# EAGLE design FM Transceiver Module (EAGLE 6.3)
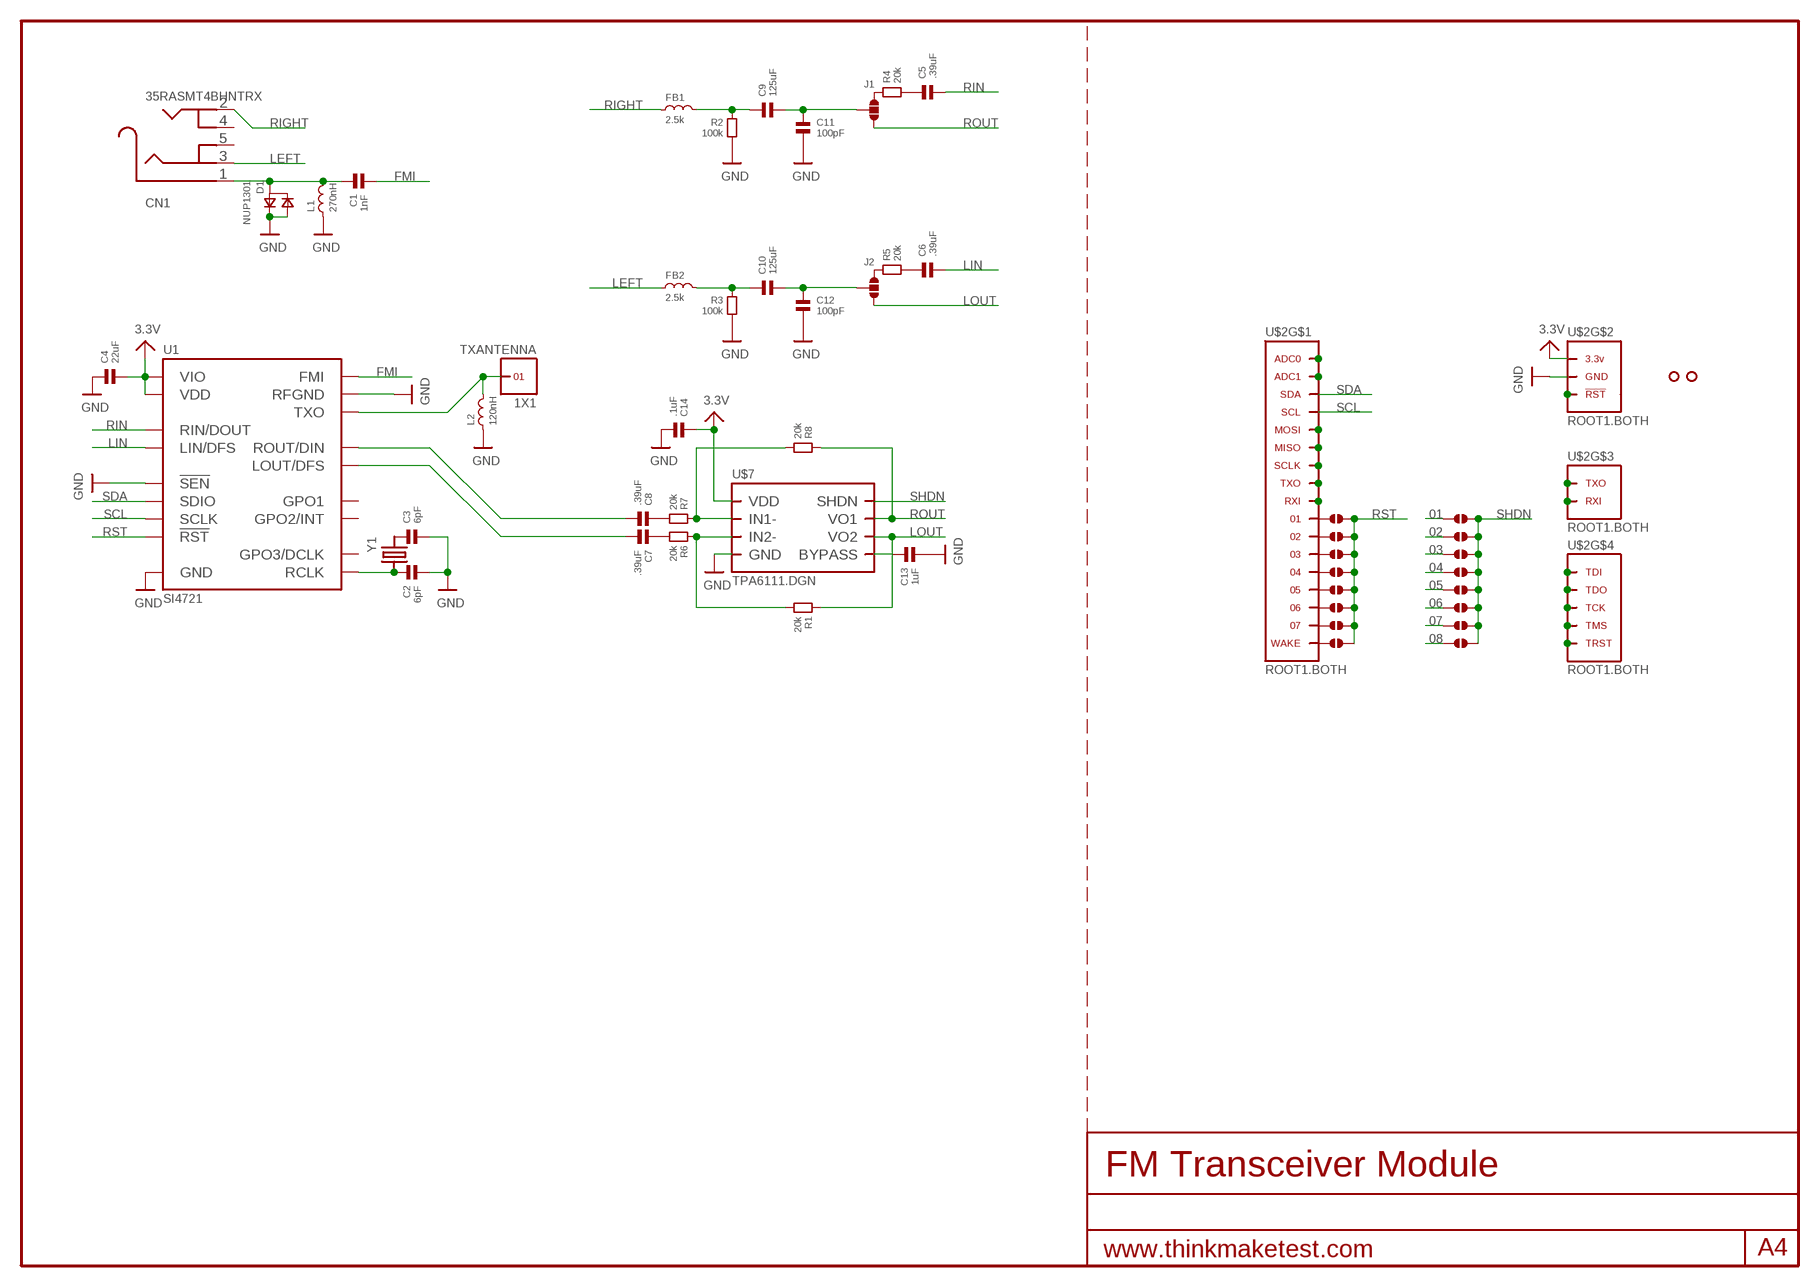
[diagram p0: schematic, sheet 1]

## Parts
C1  1nF  CAPACITOR.0603  [0603]
C2  6pF  CAPACITOR.0603  [0603]
C3  6pF  CAPACITOR.0603  [0603]
C4  22uF  CAPACITOR.0805  [0805]
C5  .39uF  CAPACITOR.0603  [0603]
C6  .39uF  CAPACITOR.0603  [0603]
C7  .39uF  CAPACITOR.0603  [0603]
C8  .39uF  CAPACITOR.0603  [0603]
C9  125uF  CAPACITOR.0603  [0603]
C10  125uF  CAPACITOR.0603  [0603]
C11  100pF  CAPACITOR.0603  [0603]
C12  100pF  CAPACITOR.0603  [0603]
C13  1uF  CAPACITOR.0603  [0603]
C14  .1uF  CAPACITOR.0603  [0603]
CN1  35RASMT4BHNTRX  AUDIO_3.5MMJACK  [4UCONN_19269]
D1  NUP1301  [SOT23]
FB1  2.5k  RF-INDUCTOR.0603  [0603]
FB2  2.5k  RF-INDUCTOR.0603  [0603]
J1  SOLDERJUMPER.3.LRG.12  [3.LRG.12]
J2  SOLDERJUMPER.3.LRG.12  [3.LRG.12]
J3  SOLDERJUMPER.2.SML  [2.SML]
J4  SOLDERJUMPER.2.SML  [2.SML]
J5  SOLDERJUMPER.2.SML  [2.SML]
J6  SOLDERJUMPER.2.SML  [2.SML]
J7  SOLDERJUMPER.2.SML  [2.SML]
J8  SOLDERJUMPER.2.SML  [2.SML]
J9  SOLDERJUMPER.2.SML  [2.SML]
J10  SOLDERJUMPER.2.SML  [2.SML]
J11  SOLDERJUMPER.2.SML  [2.SML]
J12  SOLDERJUMPER.2.SML  [2.SML]
J13  SOLDERJUMPER.2.SML  [2.SML]
J14  SOLDERJUMPER.2.SML  [2.SML]
J15  SOLDERJUMPER.2.SML  [2.SML]
J16  SOLDERJUMPER.2.SML  [2.SML]
J17  SOLDERJUMPER.2.SML  [2.SML]
J18  SOLDERJUMPER.2.SML  [2.SML]
L1  270nH  RF-INDUCTOR.0603  [0603]
L2  120nH  RF-INDUCTOR.0603  [0603]
R1  20k  RESISTOR.0603  [0603]
R2  100k  RESISTOR.0603  [0603]
R3  100k  RESISTOR.0603  [0603]
R4  20k  RESISTOR.0603  [0603]
R5  20k  RESISTOR.0603  [0603]
R6  20k  RESISTOR.0603  [0603]
R7  20k  RESISTOR.0603  [0603]
R8  20k  RESISTOR.0603  [0603]
TXANTENNA  1X1  [1X1]
U1  SI4721  SI472X  [QFN20]
U$2  ROOT1.BOTH  [ROOT1.BOTH]
U$3  HOLE.2MM  [2MM]
U$4  HOLE.2MM  [2MM]
U$7  TPA6111.DGN  [DGN]
Y1  CRYSTAL.ABS07  [ABS07]

## Nets
01: J3.1 J11.1 U$2.01 U$2.01@1 U$2.01@VIA
02: J4.1 J12.1 U$2.02 U$2.02@1 U$2.02@VIA
03: J5.1 J13.1 U$2.03 U$2.03@1 U$2.03@VIA
3.3V: C4.2 C14.1 U1.10(VIO) U1.11(VDD) U$2.3.3V@1(3.3V) U$2.3.3V@2(3.3V) U$2.3.3V@3(3.3V) U$2.3.3V@4(3.3V) U$2.3.3V@5(3.3V) U$2.3.3V@6(3.3V) U$2.3.3V@7(3.3V) U$2.3.3V@8(3.3V) U$2.3.3V@9(3.3V) U$2.3.3V@10(3.3V) U$2.3.3V@11(3.3V) U$2.3.3V@12(3.3V) U$2.3.3V@13(3.3V) U$2.3.3V@14(3.3V) U$2.3.3V@15(3.3V) U$2.3.3V@16(3.3V) U$2.3.3V@17(3.3V) U$2.3.3V@18(3.3V) U$2.3.3V@19(3.3V) U$2.3.3V@20(3.3V) U$2.3.3V@21(3.3V) U$2.3.3V@22(3.3V) U$2.3.3V@23(3.3V) U$2.3.3V@24(3.3V) U$2.3.3V@VIA(3.3V) U$7.8(VDD)
04: J6.1 J14.1 U$2.04 U$2.04@1 U$2.04@VIA
05: J7.1 J15.1 U$2.05 U$2.05@1 U$2.05@VIA
06: J8.1 J16.1 U$2.06 U$2.06@1 U$2.06@VIA
07: J9.1 J17.1 U$2.07 U$2.07@1 U$2.07@VIA
08: J10.1 J18.1 U$2.WAKE U$2.WAKE@1(WAKE) U$2.WAKE@VIA(WAKE)
FMI: C1.2 U1.2(FMI)
GND: C2.2 C3.2 C4.1 C11.2 C12.2 C13.2 C14.2 D1.1 D1.2 L1.1 L2.1 R2.2 R3.2 U1.3(RFGND) U1.6(!SEN) U1.12(GND) U1.PAD(GND) U$2.GND@1(GND) U$2.GND@2(GND) U$2.GND@3(GND) U$2.GND@4(GND) U$2.GND@5(GND) U$2.GND@6(GND) U$2.GND@7(GND) U$2.GND@8(GND) U$2.GND@9(GND) U$2.GND@10(GND) U$2.GND@11(GND) U$2.GND@12(GND) U$2.GND@13(GND) U$2.GND@14(GND) U$2.GND@15(GND) U$2.GND@16(GND) U$2.GND@17(GND) U$2.GND@18(GND) U$2.GND@19(GND) U$2.GND@20(GND) U$2.GND@21(GND) U$2.GND@22(GND) U$2.GND@23(GND) U$2.GND@24(GND) U$2.GND@25(GND) U$2.GND@26(GND) U$2.GND@VIA(GND) U$7.4(GND) U$7.PAD(GND)
LEFT: CN1.3 FB2.1
LIN: C6.2 U1.16(LIN/DFS)
LOUT: J2.3 R1.1 U$7.7(VO2)
LOUT.AMP: C7.2 U1.14(LOUT/DFS)
N$2: U$2.ADC1 U$2.ADC1@1(ADC1) U$2.ADC1@VIA(ADC1)
N$3: C13.1 U$7.3(BYPASS)
N$6: U$2.MISO U$2.MISO@1(MISO) U$2.MISO@VIA(MISO)
N$7: U$2.SCLK U$2.SCLK@1(SCLK) U$2.SCLK@VIA(SCLK)
N$8: U$2.TXO U$2.TXO@1(TXO) U$2.TXO@VIA(TXO)
N$9: U$2.RXI U$2.RXI@1(RXI) U$2.RXI@VIA(RXI)
N$12: U$2.MOSI U$2.MOSI@1(MOSI) U$2.MOSI@VIA(MOSI)
N$13: U$2.ADC0 U$2.ADC0@1(ADC0) U$2.ADC0@VIA(ADC0)
N$18: U$2.TDI U$2.TDI@1(TDI) U$2.TDI@VIA(TDI)
N$19: U$2.TDO U$2.TDO@1(TDO) U$2.TDO@VIA(TDO)
N$20: U$2.TCK U$2.TCK@1(TCK) U$2.TCK@VIA(TCK)
N$21: U$2.TMS U$2.TMS@1(TMS) U$2.TMS@VIA(TMS)
N$22: U$2.TRST U$2.TRST@1(TRST) U$2.TRST@VIA(TRST)
N$23: U$2.RXI.DBG(RXI) U$2.RXI.DBG@1(RXI) U$2.RXI.DBG@VIA(RXI)
N$24: U$2.TXO.DBG(TXO) U$2.TXO.DBG@1(TXO) U$2.TXO.DBG@VIA(TXO)
N$25: U$2.RST(!RST) U$2.RST@1(!RST) U$2.RST@VIA(!RST)
N$26: R7.1 R8.2 U$7.2(IN1-)
N$27: C1.1 CN1.1 D1.3 L1.2
N$28: C2.1 U1.9(RCLK) Y1.2
N$29: C9.2 C11.1 J1.2
N$31: C3.1 Y1.1
N$32: C10.2 C12.1 J2.2
N$33: C5.1 R4.2
N$34: C8.1 R7.2
N$35: C6.1 R5.2
N$36: C7.1 R6.2
N$37: C9.1 FB1.2 R2.1
N$38: C10.1 FB2.2 R3.1
N$39: R1.2 R6.1 U$7.6(IN2-)
N$42: J2.1 R5.1
N$43: J1.1 R4.1
RIGHT: CN1.2 FB1.1
RIN: C5.2 U1.15(RIN/DOUT)
ROUT: J1.3 R8.1 U$7.1(VO1)
ROUT.AMP: C8.2 U1.13(ROUT/DIN)
RST: J3.2 J4.2 J5.2 J6.2 J7.2 J8.2 J9.2 J10.2 U1.5(!RST)
SCL: U1.7(SCLK) U$2.SCL U$2.SCL@1(SCL) U$2.SCL@VIA(SCL)
SDA: U1.8(SDIO) U$2.SDA U$2.SDA@1(SDA) U$2.SDA@VIA(SDA)
SHDN: J11.2 J12.2 J13.2 J14.2 J15.2 J16.2 J17.2 J18.2 U$7.5(SHDN)
TXO: L2.2 TXANTENNA.1 U1.4(TXO)
Unconnected: CN1.4 CN1.5 U1.17(GPO3/DCLK) U1.18(GPO2/INT) U1.19(GPO1)

## Library data of the parts
C1-C14 = .standardparts:CAPACITOR
CN1 = microbuilder:AUDIO_3.5MMJACK: 3.5MM Audio Jack These are normally connected as follows, from left-to right on the schematic symbol above: Tip: Left Audio Inner Ring: Right Audio Shell: Common/GND
D1 = nxp:NUP1301
FB1 FB2 L1 L2 = .standardparts:RF-INDUCTOR
J1 J2 = .solderjumper:SOLDERJUMPER.3
J3-J18 = .solderjumper:SOLDERJUMPER.2
R1-R8 = .standardparts:RESISTOR
TXANTENNA = .headers(.1in):1X1
U1 = silabs:SI472X
U$2 = thinkmaketest:ROOT1
U$3 U$4 = .screw_holes:HOLE
U$7 = .packages(ti):TPA6111
Y1 = abracon:CRYSTAL

## Board
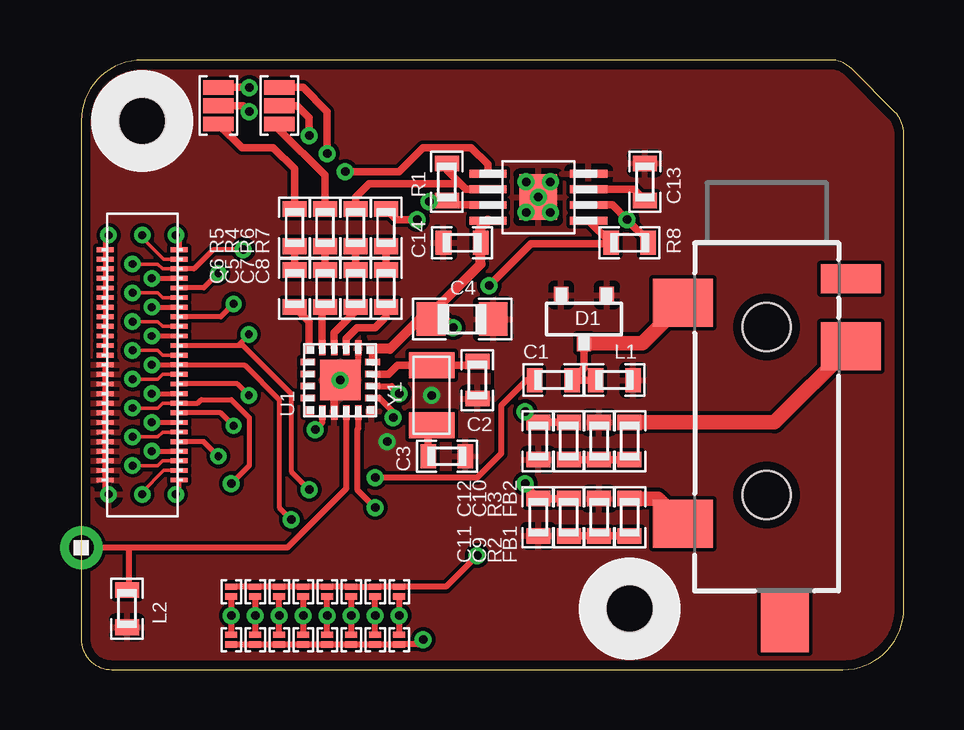
[diagram p1: board, top side]
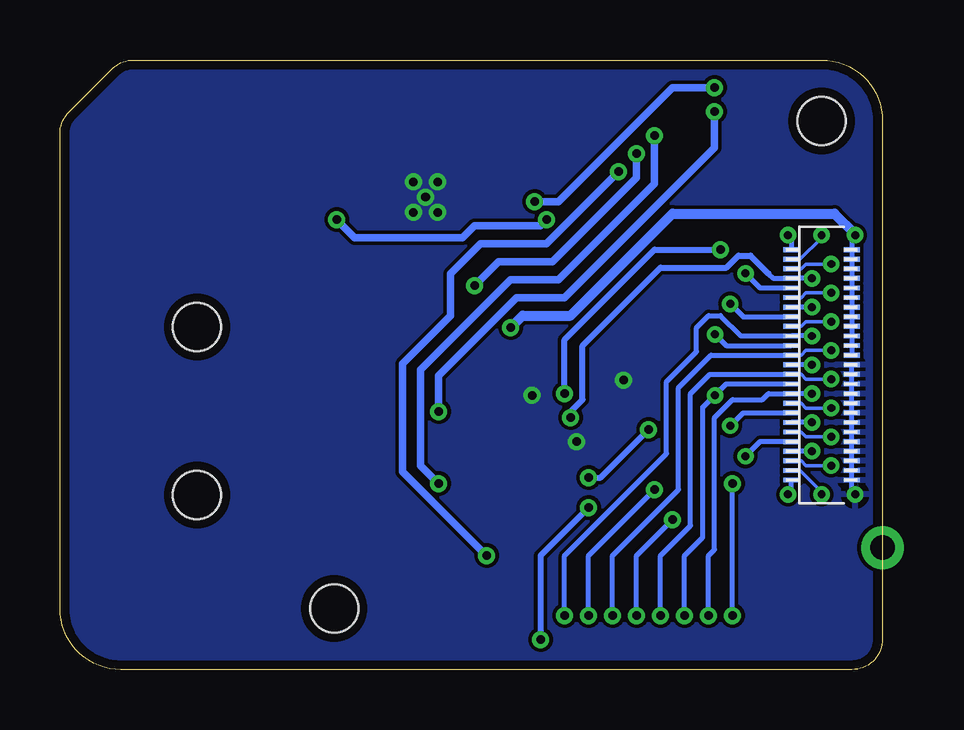
[diagram p2: board, bottom side, seen from below]

Size 34.29 x 25.4 mm. Coordinates in mm from the lower left corner, seen from the top.
Outline: 0,22.86 0,1.27 arc90 1.27,0 31.75,0 arc90 34.29,2.54 34.29,22.33 arc45 33.92,23.23 32.12,25.03 arc45 31.22,25.4 2.54,25.4 arc90 0,22.86
Copper layers (1*16): Top 0.0356mm / dielectric 1.5011mm / Bottom 0.0356mm
Design rules "default": minimum track width 6mil, minimum drill 13mil, track to track 6mil, track to pad 6mil, pad to pad 6mil, via to via 6mil, smd to smd 6mil, copper to edge 15mil, drill to drill 6mil, minimum pad ring 7mil, minimum via ring 7mil, stop-mask expansion 4mil, vias tented up to drill 16mil, thermal gap 10mil
tRestrict: 1 lines

### Footprints (pad centres in the part's own frame; a part is rotated, then mirrored left to right if it is on the bottom)
0603 = smd 0.65 x 1: 1 -0.775,0; 2 0.775,0
0805 = smd 1.2 x 1.4: 1 -1.3,0; 2 1.3,0
4UCONN_19269 = smd 2 x 2.5: 1 2.5,-3.5; 2 11.7,-3.5; 3 4.3,3.5 | smd 2.5 x 2: 4 15.8,0.75 | smd 1.2 x 2.5: 5 1.5,3.5 | hole 2: 3.5,0; 10.5,0
SOT23 = smd 0.6 x 0.7: 1 -0.95,-1; 2 0.95,-1; 3 0,1
3.LRG.12 = smd 0.61 x 1.27: 1 -0.762,0; 2 0,0; 3 0.762,0
2.SML = smd 0.254 x 0.508: 1 -0.203,0; 2 0.203,0
1X1 = drill 1.016 pad 1.778: 1 0,0
QFN20 = smd 0.4 x 0.4: 1 -1.3,1.3; 6 -1.3,-1.3; 11 1.3,-1.3; 16 1.3,1.3 | smd 0.61 x 0.28: 2 -1.345,0.75; 3 -1.345,0.25; 4 -1.345,-0.25; 5 -1.345,-0.75; 12 1.345,-0.75; 13 1.345,-0.25; 14 1.345,0.25; 15 1.345,0.75 | smd 0.28 x 0.61: 7 -0.75,-1.345; 8 -0.25,-1.345; 9 0.25,-1.345; 10 0.75,-1.345; 17 0.75,1.345; 18 0.25,1.345; 19 -0.25,1.345; 20 -0.75,1.345 | smd 1.7 x 1.7: PAD 0,0
ROOT1.BOTH = smd 0.66 x 0.2 bottom: 01 3.795,13.9; 02 3.795,13.5; 03 3.795,13.1; 3.3V@1 1.285,17.5; 3.3V@2 1.285,17.1; 3.3V@3 1.285,16.7; 3.3V@4 1.285,16.3; 3.3V@5 1.285,15.9; 3.3V@6 1.285,15.5; 3.3V@7 1.285,15.1; 3.3V@8 1.285,14.7; 3.3V@9 1.285,14.3; 3.3V@10 1.285,13.9; 3.3V@11 1.285,13.5; 3.3V@12 1.285,13.1; 04 3.795,12.7; 05 3.795,12.3; 06 3.795,11.9; 07 3.795,11.5; ADC0 3.795,17.5; ADC1 3.795,17.1; GND@1 1.285,7.9; GND@2 1.285,8.3; GND@3 1.285,8.7; GND@4 1.285,9.1; GND@5 1.285,9.5; GND@6 1.285,9.9; GND@7 1.285,10.3; GND@8 1.285,10.7; GND@9 1.285,11.1; GND@10 1.285,11.5; GND@11 1.285,11.9; GND@12 1.285,12.3; GND@13 1.285,12.7; MISO 3.795,15.5; MOSI 3.795,15.9; RST 3.795,7.9; RXI 3.795,14.3; RXI.DBG 3.795,10.3; SCL 3.795,16.3; SCLK 3.795,15.1; SDA 3.795,16.7; TCK 3.795,9.1; TDI 3.795,9.9; TDO 3.795,9.5; TMS 3.795,8.7; TRST 3.795,8.3; TXO 3.795,14.7; TXO.DBG 3.795,10.7; WAKE 3.795,11.1 | smd 0.7 x 0.2: 01@1 4.08,13.9; 02@1 4.08,13.5; 3.3V@13 1,17.5; 3.3V@14 1,17.1; 3.3V@15 1,16.7; 3.3V@16 1,16.3; 3.3V@17 1,15.9; 3.3V@18 1,15.5; 3.3V@19 1,15.1; 3.3V@20 1,14.7; 3.3V@21 1,14.3; 3.3V@22 1,13.9; 3.3V@23 1,13.5; 3.3V@24 1,13.1; 03@1 4.08,13.1; 04@1 4.08,12.7; 05@1 4.08,12.3; 06@1 4.08,11.9; 07@1 4.08,11.5; ADC0@1 4.08,17.5; ADC1@1 4.08,17.1; GND@14 1,7.9; GND@15 1,8.3; GND@16 1,8.7; GND@17 1,9.1; GND@18 1,9.5; GND@19 1,9.9; GND@20 1,10.3; GND@21 1,10.7; GND@22 1,11.1; GND@23 1,11.5; GND@24 1,11.9; GND@25 1,12.3; GND@26 1,12.7; MISO@1 4.08,15.5; MOSI@1 4.08,15.9; RST@1 4.08,7.9; RXI.DBG@1 4.08,10.3; RXI@1 4.08,14.3; SCL@1 4.08,16.3; SCLK@1 4.08,15.1; SDA@1 4.08,16.7; TCK@1 4.08,9.1; TDI@1 4.08,9.9; TDO@1 4.08,9.5; TMS@1 4.08,8.7; TRST@1 4.08,8.3; TXO.DBG@1 4.08,10.7; TXO@1 4.08,14.7; WAKE@1 4.08,11.1 | drill 0.33 pad 0.686: 01@VIA 2.94,13.9; 02@VIA 6.985,13.97; 3.3V@VIA 1.14,18.1; 03@VIA 2.14,13.3; 04@VIA 2.94,12.7; 05@VIA 2.14,12.1; 06@VIA 6.985,11.43; 07@VIA 2.94,11.5; ADC0@VIA 3.94,18.1; ADC1@VIA 2.54,18.1; GND@VIA 1.14,7.3; MISO@VIA 2.14,15.7; MOSI@VIA 5.715,16.51; RST@VIA 3.94,7.3; RXI.DBG@VIA 2.94,10.3; RXI@VIA 2.14,14.5; SCL@VIA 2.94,16.3; SCLK@VIA 2.94,15.1; SDA@VIA 2.14,16.9; TCK@VIA 2.94,9.1; TDI@VIA 2.14,9.7; TDO@VIA 5.715,8.89; TMS@VIA 2.14,8.5; TRST@VIA 2.54,7.3; TXO.DBG@VIA 6.35,10.16; TXO@VIA 6.35,15.24; WAKE@VIA 2.14,10.9
2MM = hole 2: 0,0
DGN = smd 0.33 x 1.55: 1 -0.975,-2.1; 2 -0.325,-2.1; 3 0.325,-2.1; 4 0.975,-2.1; 5 0.975,2.1; 6 0.325,2.1; 7 -0.325,2.1; 8 -0.975,2.1 | smd 1.89 x 1.57: PAD 0,0
ABS07 = smd 1.1 x 1.9: 1 -1.25,0; 2 1.25,0

### Placement (x,y rotation side)
C1  19.68,12.06 180 top
C2  16.51,12.06 270 top
C3  15.24,8.89 0 top
C4  15.88,14.61 180 top
C5  10.16,15.88 270 top
C6  8.89,15.88 270 top
C7  11.43,15.88 270 top
C8  12.7,15.88 270 top
C9  20.32,6.35 90 top
C10  20.32,9.53 90 top
C11  19.05,6.35 270 top
C12  19.05,9.53 270 top
C13  23.5,20.32 90 top
C14  15.88,17.78 180 top
CN1  28.57,17.78 270 top
D1  20.95,14.61 180 top
FB1  22.86,6.35 270 top
FB2  22.86,9.53 270 top
J1  8.26,23.5 90 top
J2  5.71,23.5 90 top
J3  13.25,1.25 270 top
J4  12.25,1.25 270 top
J5  11.25,1.25 270 top
J6  10.25,1.25 270 top
J7  9.25,1.25 270 top
J8  8.25,1.25 270 top
J9  7.25,1.25 270 top
J10  6.25,1.25 270 top
J11  13.25,3.25 90 top
J12  12.25,3.25 90 top
J13  11.25,3.25 90 top
J14  10.25,3.25 90 top
J15  9.25,3.25 90 top
J16  8.25,3.25 90 top
J17  7.25,3.25 90 top
J18  6.25,3.25 90 top
L1  22.23,12.06 180 top
L2  1.91,2.54 90 top
R1  15.24,20.32 90 top
R2  21.59,6.35 90 top
R3  21.59,9.53 90 top
R4  10.16,18.41 270 top
R5  8.89,18.41 270 top
R6  11.43,18.41 270 top
R7  12.7,18.41 270 top
R8  22.86,17.78 0 top
TXANTENNA  0,5.08 0 top
U1  10.79,12.06 90 top
U$2  0,0 0 top
U$3  22.86,2.54 90 top
U$4  2.54,22.86 90 top
U$7  19.05,19.68 90 top
Y1  14.61,11.43 90 top

### Tracks (layer width: path | path; a pad name or v marks a point on that pad's centre or on a via)
01  (via drill 0.36)
  Top 0.254: J11.1 v13.25,2.25 J3.1
  Bottom 0.203: v13.25,2.25 13.25,4.75 9,9 9,12 7.75,13.25 7.75,14.25 7.25,14.75 6.75,14.75 5.9,13.9 U$2.01
02  (via drill 0.36)
  Top 0.203: v9.5,7.5 8.75,8.25 8.75,11.5 6.75,13.5 6.51,13.5
  Top 0.254: J4.1 v12.25,2.25 J12.1
  Bottom 0.203: v12.25,2.25 12.25,4.75 v9.5,7.5
03  (via drill 0.36)
  Top 0.254: J13.1 v11.25,2.25 J5.1
  Bottom 0.203: v11.25,2.25 11.25,4.75 8.5,7.5 8.5,11.75 7.15,13.1 U$2.03
3.3V  (via drill 0.36)
  Top 0.305: U1.10 12.14,13.32 U1.11
  Top 0.406: C4.2 14.11,14.61 12.87,13.37 U1.11 | C4.2 14.57,14.82 16.65,16.9 C14.1 16.65,18.41 U$7.8 | C4.2 15.14,14.61 v15.5,14.25
  Bottom 0.406: v15.5,14.25 15,14.75 13,14.75 8.75,19 2,19 1.14,18.14 U$2.3.3V@VIA
04  (via drill 0.36)
  Top 0.203: U$2.04@1 6.8,12.7 8.25,11.25 8.25,6.75 v8.75,6.25
  Top 0.254: J6.1 v10.25,2.25 J14.1
  Bottom 0.203: v10.25,2.25 10.25,4.75 v8.75,6.25
05  (via drill 0.36)
  Top 0.254: J15.1 v9.25,2.25 J7.1
  Bottom 0.203: v9.25,2.25 9.25,4.75 8,6 8,11.5 7.2,12.3 U$2.05
06  (via drill 0.36)
  Top 0.254: J8.1 v8.25,2.25 J16.1
  Bottom 0.203: v8.25,2.25 8.25,4.75 7.5,5.5 7.5,10.91 U$2.06@VIA
07  (via drill 0.36)
  Top 0.254: J17.1 v7.25,2.25 J9.1
  Bottom 0.203: v7.25,2.25 7.25,4.75 7,5 7,10.5 6.25,11.25 5,11.25 4.75,11.5 U$2.07
08  (via drill 0.36)
  Top 0.203: U$2.WAKE@1 4.85,11.1 5,11.25 6.25,11.25 7,10.5 7,8.5 v6.25,7.75
  Top 0.254: J18.1 v6.25,2.25 J10.1
  Bottom 0.203: v6.25,2.25 v6.25,7.75
FMI  (via drill 0.36)
  Top 0.254: C1.2 18.57,12.06 17.5,11 17.5,9 16.5,8 v12.25,8 | U1.2 10.04,10.29 v9.75,10
  Bottom 0.254: v12.25,8 11.75,8 v9.75,10
GND  (via drill 0.36)
  Top 0.254: U1.12 11.54,12.81 U1.PAD
  Top 0.305: U1.3 10.54,11.81 U1.PAD
  other vias: 19.05,19.68 19.56,20.32 18.54,20.32 18.54,19.05 19.56,19.05 14.61,11.43 12.75,9.5 10.79,12.06
  pour Bottom (rank 6): 0,0 34.29,0 34.29,25.4 0,25.4
  pour Top (rank 6): 0,0 34.29,0 34.29,25.4 0,25.4
LEFT
  Top 0.61: CN1.3 28.89,10.3 FB2.1
LIN
  Top 0.305: U1.16 9.49,14.49 C6.2
LOUT  (via drill 0.36)
  Top 0.305: U$7.7 15.43,19.36 R1.1 15.2,19.5 v14.5,19.5 | v7,24.25 v6.99,24.26 J2.3
  Bottom 0.305: v14.5,19.5 13.5,19.5 8.75,24.25 v7,24.25
LOUT.AMP
  Top 0.305: U1.14 10.54,14.04 11.43,14.93 C7.2
N$3
  Top 0.305: C13.1 23.03,20.01 U$7.3
N$12
  Bottom 0.152: U$2.MOSI 4.94,15.9
N$26  (via drill 0.36)
  Top 0.305: U$7.2 22.14,19.36 v22.75,18.75 23.64,17.86 R8.2 | R7.1 13.14,18.75 v14,18.75
  Bottom 0.305: v14,18.75 14.25,18.5 17,18.5 17.5,18 22,18 v22.75,18.75
N$27
  Top 0.305: L1.2 C1.1 20.95,12.56 D1.3
  Top 0.61: CN1.1 23.4,13.61 D1.3
N$28
  Top 0.305: U1.9 12.81,12.31 13.18,12.68 Y1.2 16.35,12.68 C2.1
N$29  (via drill 0.36)
  Top 0.305: C9.2 C11.1 18.5,7.67 v18.5,7.75 | J1.2 9.01,23.5 9.5,23 v9.5,22.25
  Bottom 0.305: v18.5,7.75 19.25,8.5 19.25,12.5 15.5,16.25 13.5,16.25 9.5,20.25 v9.5,22.25
N$31
  Top 0.305: Y1.1 14.46,10.18 C3.1
N$32  (via drill 0.36)
  Top 0.305: C10.2 C12.1 18.95,10.3 v18.5,10.75 | v7,23.25 6.75,23.5 J2.2
  Bottom 0.305: v7,23.25 7,21.75 13.25,15.5 15.25,15.5 18.5,12.25 v18.5,10.75
N$33
  Top 0.305: C5.1 R4.2
N$34
  Top 0.305: R7.2 C8.1
N$35
  Top 0.305: R5.2 C6.1
N$36
  Top 0.305: R6.2 C7.1
N$37
  Top 0.305: C9.1 R2.1 FB1.2
N$38
  Top 0.305: FB2.2 R3.1 C10.1
N$39
  Top 0.305: U$7.6 16.04,20.01 15.8,20.25 | R6.1 11.43,19.68 12,20.25 15.8,20.25 | 15.8,20.25 15.24,20.81 R1.2
N$42
  Top 0.305: J2.1 6.7,21.75 8,21.75 8.89,20.86 R5.1
N$43
  Top 0.305: J1.1 8.26,22.5 10.16,20.59 R4.1
RIGHT
  Top 0.61: CN1.2 24.03,7.12 FB1.1
RIN
  Top 0.305: U1.15 10.04,14.98 C5.2
ROUT  (via drill 0.36)
  Top 0.305: R8.1 | R8.1 U$7.1 | v10.25,21.5 10.25,23.25 9.24,24.26 J1.3 | R8.1 22.05,17.75 18.75,17.75 v17,16
  Bottom 0.305: v10.25,21.5 10.25,20.5 13.75,17 16,17 v17,16
ROUT.AMP
  Top 0.254: 12.7,14.7 C8.2
  Top 0.305: U1.13 11.04,13.79 11.5,14.25 12.25,14.25 12.7,14.7
RST  (via drill 0.36)
  Top 0.254: J10.2 J9.2 J8.2 J7.2 J6.2 J5.2 J4.2 J3.2 14.05,1.05 v14.25,1.25 | U1.5 11.54,10.04 11.5,10 11.5,7.5 v12.25,6.75
  Bottom 0.254: v14.25,1.25 14.25,4.75 v12.25,6.75
SCL  (via drill 0.36)
  Top 0.254: U1.7 12.44,11.31 13,10.75 v13,10.5
  Bottom 0.203: 4.3,16.3 U$2.SCL 4.55,16.3 4.75,16.5
  Bottom 0.254: v13,10.5 13,10.75 12.5,11.25 12.5,13.5 9.25,16.75 6.5,16.75 6,17.25 5.5,17.25 4.75,16.5
SDA  (via drill 0.36)
  Top 0.203: v6.75,17.5 5.5,17.5 4.7,16.7 U$2.SDA@1
  Top 0.254: U1.8 12.94,11.81 v13.25,11.5
  Bottom 0.254: v13.25,11.5 13.25,13.75 9.5,17.5 v6.75,17.5
SHDN  (via drill 0.36)
  Top 0.254: J18.2 J17.2 J16.2 J15.2 J14.2 J13.2 J12.2 J11.2 15.2,3.45 v16.5,4.75
  Top 0.305: U$7.5 16.95,21.05 16.25,21.75 14.25,21.75 13.25,20.75 v11,20.75
  Bottom 0.305: v11,20.75 14,17.75 16.75,17.75 18,16.5 18,14.75 20,12.75 20,8.25 v16.5,4.75
TXO
  Top 0.254: U1.4 11.04,7.54 8.58,5.08 2,5.08 | 2,5.08 TXANTENNA.1 | L2.2 2,3.41 2,5.08

### Text on the board
tDocu: Transmitter / Receiver | ANT | 08 | 07 | 06 | 05 | 04 | 03 | 02 | 01 | SHDN | RST
bDocu: Cruz Monrreal II | v1 | AnomalousMaker.com